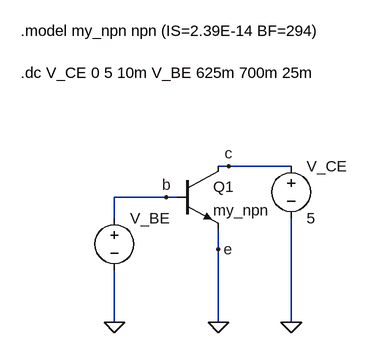
[diagram p0: schematic 1_2.asc]
1_2.asc, the LTspice schematic file:
Version 4.1
SHEET 1 880 680
WIRE 16 16 0 16
WIRE 112 16 16 16
WIRE -80 64 -160 64
WIRE -64 64 -80 64
WIRE -160 96 -160 64
WIRE 0 144 0 112
WIRE -160 256 -160 176
WIRE 0 256 0 144
WIRE 112 256 112 96
FLAG 0 256 0
FLAG -160 256 0
FLAG 112 256 0
FLAG 16 16 c
FLAG 0 144 e
FLAG -80 64 b
SYMBOL voltage -160 80 R0
SYMATTR InstName V_BE
SYMATTR Value ""
SYMBOL voltage 112 0 R0
WINDOW 123 0 0 Left 0
WINDOW 39 0 0 Left 0
SYMATTR InstName V_CE
SYMATTR Value 5
SYMBOL npn -64 16 R0
SYMATTR InstName Q1
SYMATTR Value my_npn
TEXT -304 -128 Left 2 !.dc V_CE 0 5 10m V_BE 625m 700m 25m
TEXT -304 -192 Left 2 !.model my_npn npn (IS=2.39E-14 BF=294)

The netlist it stands for:
* 1_2.asc
V_BE b 0
V_CE c 0 5
Q1 c b 0 0 my_npn
.model NPN NPN
.model PNP PNP
.lib standard.bjt
.dc V_CE 0 5 10m V_BE 625m 700m 25m
.model my_npn npn (IS=2.39E-14 BF=294)
.backanno
.end